# Altium project DIT_MCU_Board.PrjPcb
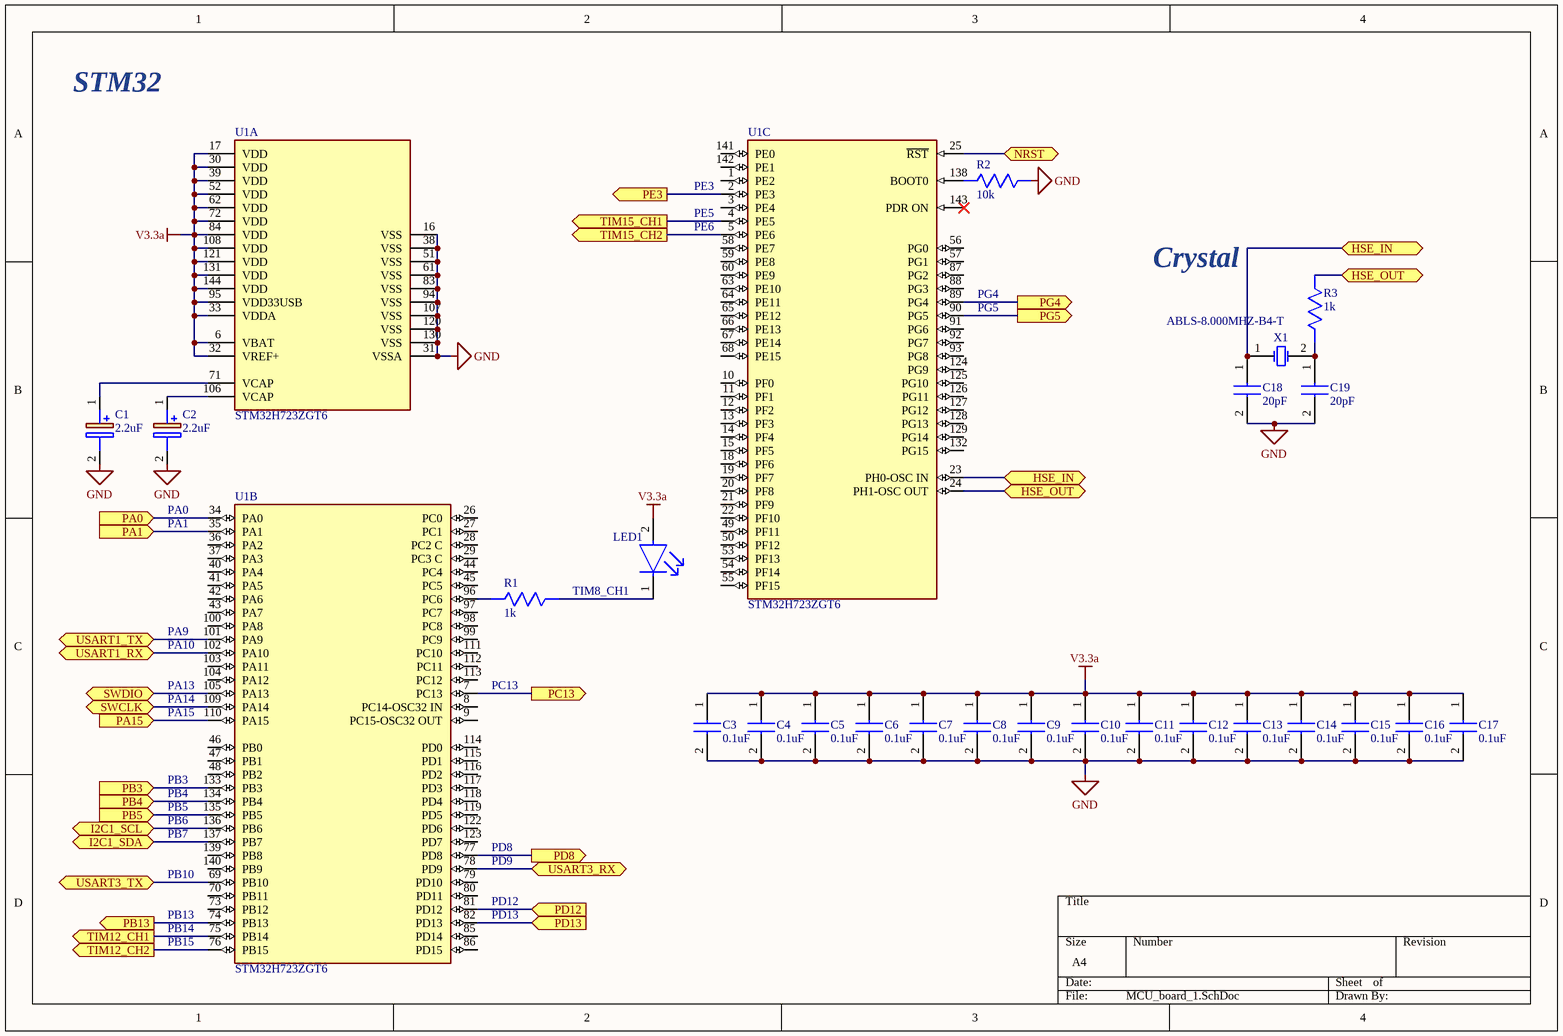
[diagram p0: MCU_board_1.SchDoc]
3 sheets, 82 parts. Net scope: flat (ports and power ports of the same name join across sheets).
Board file: PCB2.PcbDoc
Sheets:
  MCU_board_1.SchDoc
  MCU_board_2.SchDoc
  MCU_board_3.SchDoc

## Sheet MCU_board_1.SchDoc
size A4; SheetNumber: 1; SheetTotal: 3

### Parts
(Parts that share a designator on the sheet are numbered #1, #2 ... from top to bottom, then left to right.)
C1  2.2uF  [T598B]
C2  2.2uF  [T598B]
C3  0.1uF  [CAPC1608X90N]
C4  0.1uF  [CAPC1608X90N]
C5  0.1uF  [CAPC1608X90N]
C6  0.1uF  [CAPC1608X90N]
C7  0.1uF  [CAPC1608X90N]
C8  0.1uF  [CAPC1608X90N]
C9  0.1uF  [CAPC1608X90N]
C10  0.1uF  [CAPC1608X90N]
C11  0.1uF  [CAPC1608X90N]
C12  0.1uF  [CAPC1608X90N]
C13  0.1uF  [CAPC1608X90N]
C14  0.1uF  [CAPC1608X90N]
C15  0.1uF  [CAPC1608X90N]
C16  0.1uF  [CAPC1608X90N]
C17  0.1uF  [CAPC1608X90N]
C18  20pF  [CAPC1608X90N]
C19  20pF  [CAPC1608X90N]
LED1  150060RS75000  [FP-150060RS75000-MFG]  (value not drawn)
R1  1k  [RESC1608X55N]
R2  10k  [RESC1608X55N]
R3  1k  [RESC1608X55N]
U1#1  STM32H723ZGT6  [FP-LQFP144-1A-IPC_A]  (part A of 3)
U1#2  STM32H723ZGT6  [FP-LQFP144-1A-IPC_C]  (parts B,C of 3)
X1  ABLS-8.000MHZ-B4-T  [ABRA-ABLS-14.7456MHZ-B2-T_V]

### Ports
HSE_IN (bidir, see MCU_board_1[3B]), HSE_IN (bidir, see MCU_board_1[4A]), HSE_OUT (bidir, see MCU_board_1[3B]), HSE_OUT (bidir, see MCU_board_1[4B]), I2C1_SCL (bidir, see MCU_board_3[1B]), I2C1_SDA (bidir, see MCU_board_3[1B]), NRST (bidir, see MCU_board_2[1C], MCU_board_2[2C], MCU_board_3[1C]), PA0 (in, see MCU_board_3[3C]), PA1 (in, see MCU_board_3[3C]), PA15 (in, see MCU_board_3[2C]), PB3 (in, see MCU_board_3[1C], MCU_board_3[2C]), PB4 (in, see MCU_board_3[3C]), PB5 (in, see MCU_board_3[3C]), PB13 (out, see MCU_board_3[3D]), PC13 (out, see MCU_board_3[3D]), PD8 (out, see MCU_board_3[3D]), PD12 (in, see MCU_board_3[4C]), PD13 (in, see MCU_board_3[4C]), PE3 (out, see MCU_board_3[3D]), PG4 (out, see MCU_board_2[1D]), PG5 (out, see MCU_board_2[2D]), SWCLK (bidir, see MCU_board_3[2C]), SWDIO (bidir, see MCU_board_3[2C]), TIM12_CH1 (out, see MCU_board_3[3D]), TIM12_CH2 (out, see MCU_board_3[3D]), TIM15_CH1 (out, see MCU_board_3[3D]), TIM15_CH2 (out, see MCU_board_3[3C]), USART1_RX (bidir, see MCU_board_2[4C], MCU_board_3[1A]), USART1_TX (bidir, see MCU_board_2[4C], MCU_board_3[1A]), USART3_RX (bidir, see MCU_board_3[2A]), USART3_TX (bidir, see MCU_board_3[2A])

### Nets
GND: C1.2(-) C2.2(-) C3.2 C4.2 C5.2 C6.2 C7.2 C8.2 C9.2 C10.2 C11.2 C12.2 C13.2 C14.2 C15.2 C16.2 C17.2 C18.2 C19.2 R2.2 U1#1.16(VSS) U1#1.31(VSSA) U1#1.38(VSS) U1#1.51(VSS) U1#1.61(VSS) U1#1.83(VSS) U1#1.94(VSS) U1#1.107(VSS) U1#1.120(VSS) U1#1.130(VSS)
V3.3a: C3.1 C4.1 C5.1 C6.1 C7.1 C8.1 C9.1 C10.1 C11.1 C12.1 C13.1 C14.1 C15.1 C16.1 C17.1 LED1.2(A) U1#1.6(VBAT) U1#1.17(VDD) U1#1.30(VDD) U1#1.32(VREF+) U1#1.33(VDDA) U1#1.39(VDD) U1#1.52(VDD) U1#1.62(VDD) U1#1.72(VDD) U1#1.84(VDD) U1#1.95(VDD33USB) U1#1.108(VDD) U1#1.121(VDD) U1#1.131(VDD) U1#1.144(VDD)
NetC1_1: C1.1(+) U1#1.71(VCAP)
NetC2_1: C2.1(+) U1#1.106(VCAP)
NetC18_1: C18.1 U1#2.23(PH0-OSC_IN) X1.1(X1) ; port HSE_IN
NetC19_1: C19.1 R3.1 X1.2(X2)
NetC23_1: U1#2.25(~{RST}) ; port NRST
NetLED1_1: LED1.1(C) R1.2
NetP2_1: U1#2.89(PG4) ; port PG4
NetP3_1: U1#2.90(PG5) ; port PG5
NetP4_2: U1#2.101(PA9) ; port USART1_TX
NetP4_3: U1#2.102(PA10) ; port USART1_RX
NetP5_2: U1#2.69(PB10) ; port USART3_TX
NetP5_3: U1#2.78(PD9) ; port USART3_RX
NetP6_3: U1#2.137(PB7) ; port I2C1_SDA
NetP6_4: U1#2.136(PB6) ; port I2C1_SCL
NetP7_2: U1#2.105(PA13) ; port SWDIO
NetP7_5: U1#2.133(PB3) ; port PB3
NetP7_6: U1#2.109(PA14) ; port SWCLK
NetP8_1: U1#2.5(PE6) ; port TIM15_CH2
NetP8_2: U1#2.7(PC13) ; port PC13
NetP8_3: U1#2.4(PE5) ; port TIM15_CH1
NetP8_4: U1#2.2(PE3) ; port PE3
NetP8_5: U1#2.76(PB15) ; port TIM12_CH2
NetP8_6: U1#2.74(PB13) ; port PB13
NetP8_7: U1#2.75(PB14) ; port TIM12_CH1
NetP8_8: U1#2.77(PD8) ; port PD8
NetR1_1: R1.1 U1#2.96(PC6)
NetR2_1: R2.1 U1#2.138(BOOT0)
NetR3_2: R3.2 U1#2.24(PH1-OSC_OUT) ; port HSE_OUT
NetU1#2_34: U1#2.34(PA0) ; port PA0
NetU1#2_35: U1#2.35(PA1) ; port PA1
NetU1#2_81: U1#2.81(PD12) ; port PD12
NetU1#2_82: U1#2.82(PD13) ; port PD13
NetU1#2_110: U1#2.110(PA15) ; port PA15
NetU1#2_134: U1#2.134(PB4) ; port PB4
NetU1#2_135: U1#2.135(PB5) ; port PB5

Not connected (* = marked no-connect by the designer): U1#2 1(PE2) 3(PE4) 8(PC14-OSC32_IN) 9(PC15-OSC32_OUT) 10(PF0) 11(PF1) 12(PF2) 13(PF3) 14(PF4) 15(PF5) 18(PF6) 19(PF7) 20(PF8) 21(PF9) 22(PF10) 26(PC0) 27(PC1) 28(PC2_C) 29(PC3_C) 36(PA2) 37(PA3) 40(PA4) 41(PA5) 42(PA6) 43(PA7) 44(PC4) 45(PC5) 46(PB0) 47(PB1) 48(PB2) 49(PF11) 50(PF12) 53(PF13) 54(PF14) 55(PF15) 56(PG0) 57(PG1) 58(PE7) 59(PE8) 60(PE9) 63(PE10) 64(PE11) 65(PE12) 66(PE13) 67(PE14) 68(PE15) 70(PB11) 73(PB12) 79(PD10) 80(PD11) 85(PD14) 86(PD15) 87(PG2) 88(PG3) 91(PG6) 92(PG7) 93(PG8) 97(PC7) 98(PC8) 99(PC9) 100(PA8) 103(PA11) 104(PA12) 111(PC10) 112(PC11) 113(PC12) 114(PD0) 115(PD1) 116(PD2) 117(PD3) 118(PD4) 119(PD5) 122(PD6) 123(PD7) 124(PG9) 125(PG10) 126(PG11) 127(PG12) 128(PG13) 129(PG14) 132(PG15) 139(PB8) 140(PB9) 141(PE0) 142(PE1) 143(PDR_ON)*

### Notes on the sheet
- STM32
- (near U1#2) PE3
- (near U1#2) PE5
- (near U1#2) PE6
- (near U1#2) PG4
- (near U1#2) PG5
- Crystal
- PA0
- PA1
- (near U1#2) PA9
- (near U1#2) PA10
- TIM8_CH1
- (near U1#2) PA13
- (near U1#2) PA14
- (near U1#2) PA15
- (near U1#2) PC13
- (near U1#2) PB3
- (near U1#2) PB4
- (near U1#2) PB5
- (near U1#2) PB6
- (near U1#2) PB7
- (near U1#2) PD8
- (near U1#2) PB10
- (near U1#2) PB13
- (near U1#2) PD9
- (near U1#2) PD12
- (near U1#2) PD13
- (near U1#2) PB14
- (near U1#2) PB15

### Library data of the parts
C1 C2 = T598B225M035ATE150: Capacitor Polarised; Manufacturer_Name: KEMET; Datasheet Link: https://content.kemet.com/datasheets/KEM_T2073_T59X.pdf; Height: 2.1mm; Manufacturer_Part_Number: T598B225M035ATE150; Mouser Part Number: 80-T598B225M35ATE150; Mouser Price/Stock: https://www.mouser.co.uk/ProductDetail/KEMET/T598B225M035ATE150?qs=wnTfsH77Xs5uc%252Bb8LBvYtg%3D%3D
C3-C17 = GRM188R72A104MA35D: Capacitor; Manufacturer_Name: Murata Electronics; Height: 0.9mm; Manufacturer_Part_Number: GRM188R72A104MA35D; Mouser Part Number: 81-GRM188R72A104MA5D; Mouser Price/Stock: https://www.mouser.co.uk/ProductDetail/Murata-Electronics/GRM188R72A104MA35D?qs=QdePRyQsNGaEtttrWFG%2FPQ%3D%3D; Arrow Part Number: GRM188R72A104MA35D; Arrow Price/Stock: https://www.arrow.com/en/products/grm188r72a104ma35d/murata-manufacturing?region=nac
C18 C19 = 06035A200FAT2A: Capacitor; Manufacturer_Name: AVX; Datasheet Link: https://componentsearchengine.com/Datasheets/1/06031A100FAT2A.pdf; Height: 0.9mm; Manufacturer_Part_Number: 06035A200FAT2A; Mouser Part Number: 581-06035A200FAT2A; Mouser Price/Stock: https://www.mouser.co.uk/ProductDetail/AVX/06035A200FAT2A?qs=0yaOSdwiqWsd0YnmvPoF5Q%3D%3D
LED1 = CMP-1426-00001-2: LED RED CLEAR 0603 SMD; Luminous Intensity: 250mcd; Viewing Angle: 140°; Dominant Wavelength: 625nm; Test Current: 20mA; Forward Current: 30mA; Forward Voltage: 2V; Lens Color: Colorless; Lens Size: 0.7mm; Width: 0.8mm; Series: WL-SMCW; Color: Red; Min Operating Temperature: -40°C; RoHS Compliant: Yes; Height: 0.8mm; Package Quantity: 1; Packaging: Cut Tape; Mount: Surface Mount; Case/Package: 0603; Lens Transparency: Clear; Length: 1.6mm; Case Code (Imperial): 0603; Lens Style: Clear; Wavelength: 625nm; Max Operating Temperature: 85°C; Case Code (Metric): 1608
R1-R3 = CMP0603-FX-1003ELF: Resistor; Manufacturer_Name: Bourns; Datasheet Link: https://www.mouser.co.uk/datasheet/2/54/Bourns_CMP_Datasheet_05.28.20-1854233.pdf; Height: 0.55mm; Manufacturer_Part_Number: CMP0603-FX-1003ELF
U1#1 U1#2 = CMP-12105-000148-1: IC MCU 32BIT 1MB FLASH 144LQFP
X1 = CMP-2000-05726-1: Low Profile Crystal, 8.0 MHz, +/- 30 ppm, -20 to 70 degC, 2-Pin SMD, RoHS, Tape and Reel; Brand: ABRACON; Case Length: 11.4mm; Frequency Stability: 50PPM; ESR: 80Ohms; Case Height: 4.2mm; Tolerance: 30PPM; Frequency: 8MHz; Case Width: 4.7mm; Load Capacitance: 18pF; Datasheet Version: 04/2011; Termination Style: SMD/SMT; Dimensions: 4.7mmWx11.4mmLx4.2mmH; Packaging: Reel; Manufacturer: ABRACON; Package URL: http://www.abracon.com/Support/PackageDrawing/Resonators/ABLS-2D.pdf; Mounting Technology: SurfaceMount; Package Reference: ABLS-14.7456MHZ-B2-T; Product Category: Crystals; Package Description: 2-Pin Surface Mount Device, Body 11.4 x 4.7 mm; Package / Case: HC-49/US; Mounting Style: SMD/SMT; Operating Temperature Range: -20Cto+70C; Series: ABLS; Factory Pack Quantity: 1000; Datasheet URL: http://www.abracon.com/Resonators/abls.pdf; Manufacturer URL: http://www.abracon.com/; RoHS: Details; Type: LowProfileMicroprocessorCrystal

## Sheet MCU_board_2.SchDoc
size A4; SheetNumber: 2; SheetTotal: 3
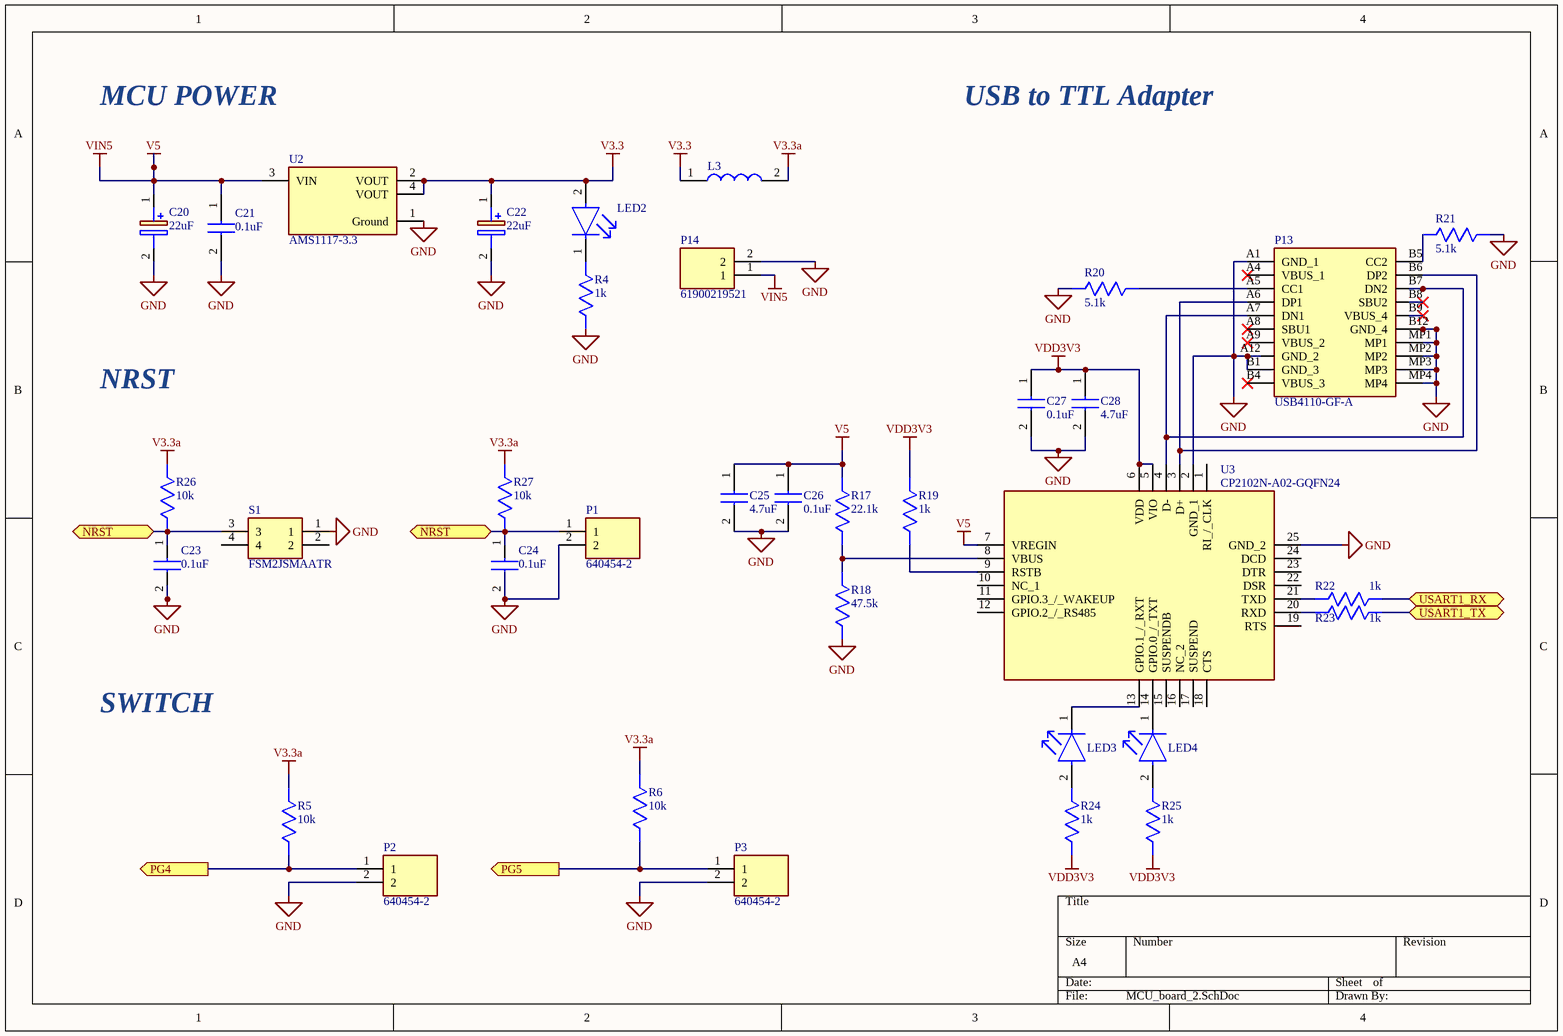
[diagram p1: MCU_board_2.SchDoc]

### Parts
C20  22uF  [CAPPM6032X280N]
C21  0.1uF  [C1608_Commercial]
C22  22uF  [CAPPM6032X280N]
C23  0.1uF  [C1608_Commercial]
C24  0.1uF  [C1608_Commercial]
C25  4.7uF  [CAPC1608X90N]
C26  0.1uF  [CAPC1608X90N]
C27  0.1uF  [CAPC1608X90N]
C28  4.7uF  [CAPC1608X90N]
L3  742792691  [LEDC1608X80N]  (value not drawn)
LED2  150060RS75000  [FP-150060RS75000-MFG]  (value not drawn)
LED3  150060RS75000  [FP-150060RS75000-MFG]  (value not drawn)
LED4  150060RS75000  [FP-150060RS75000-MFG]  (value not drawn)
P1  640454-2  [HDRV2W66P0X254_1X2_762X572X1003P]
P2  640454-2  [HDRV2W66P0X254_1X2_762X572X1003P]
P3  640454-2  [HDRV2W66P0X254_1X2_762X572X1003P]
P13  USB4110-GF-A  [USB4110GFA]
P14  61900219521  [SHDRRA2W64P0X254_1X2_508X1150X595P]
R4  1k  [RESC1608X55N]
R5  10k  [RESC1608X55N]
R6  10k  [RESC1608X55N]
R17  22.1k  [RESC1608X55N]
R18  47.5k  [RESC1608X55N]
R19  1k  [RESC1608X55N]
R20  5.1k  [RESC1608X55N]
R21  5.1k  [RESC1608X55N]
R22  1k  [RESC1608X55N]
R23  1k  [RESC1608X55N]
R24  1k  [RESC1608X55N]
R25  1k  [RESC1608X55N]
R26  10k  [RESC1608X55N]
R27  10k  [RESC1608X55N]
S1  FSM2JSMAATR  [FSM2J_1]
U2  AMS1117-3.3  [FP-AMS1117-IPC_C]
U3  CP2102N-A02-GQFN24  [QFN50P400X400X80-25N-D]

### Ports
NRST (bidir, see MCU_board_1[3A], MCU_board_2[1C], MCU_board_3[1C]), NRST (bidir, see MCU_board_1[3A], MCU_board_2[2C], MCU_board_3[1C]), PG4 (out, see MCU_board_1[3B]), PG5 (out, see MCU_board_1[3B]), USART1_RX (bidir, see MCU_board_1[1C], MCU_board_3[1A]), USART1_TX (bidir, see MCU_board_1[1C], MCU_board_3[1A])

### Nets
GND: C20.2(-) C21.2 C22.2(-) C23.2 C24.2 C25.2 C26.2 C27.2 C28.2 P1.2 P2.2 P3.2 P13.A1(GND_1) P13.A12(GND_2) P13.B1(GND_3) P13.B12(GND_4) P13.MP1 P13.MP2 P13.MP3 P13.MP4 P14.2 R4.2 R18.2 R20.2 R21.2 S1.1 U2.1(Ground) U3.2(GND_1) U3.25(GND_2)
V3.3: C22.1(+) L3.1 LED2.2(A) U2.2(VOUT) U2.4(VOUT)
V3.3a: L3.2 R5.2 R6.2 R26.2 R27.2
V5: C20.1(+) C21.1 C25.1 C26.1 P14.1 R17.1 U2.3(VIN) U3.7(VREGIN)  [also labelled VIN5]
VDD3V3: C27.1 C28.1 R19.1 R24.2 R25.2 U3.5(VIO) U3.6(VDD)
NetC23_1: C23.1 C24.1 P1.1 R26.1 R27.1 S1.3 ; port NRST
NetLED2_1: LED2.1(C) R4.1
NetLED3_1: LED3.1(C) U3.13(GPIO.1_/_RXT)
NetLED3_2: LED3.2(A) R24.1
NetLED4_1: LED4.1(C) U3.14(GPIO.0_/_TXT)
NetLED4_2: LED4.2(A) R25.1
NetP2_1: P2.1 R5.1 ; port PG4
NetP3_1: P3.1 R6.1 ; port PG5
NetP4_2: R23.2 ; port USART1_TX
NetP4_3: R22.2 ; port USART1_RX
NetP13_A5: P13.A5(CC1) R20.1
NetP13_A6: P13.A6(DP1) P13.B6(DP2) U3.3(D+)
NetP13_A7: P13.A7(DN1) P13.B7(DN2) U3.4(D-)
NetP13_B5: P13.B5(CC2) R21.1
NetR17_2: R17.2 R18.1 U3.8(VBUS)
NetR19_2: R19.2 U3.9(RSTB)
NetR22_1: R22.1 U3.21(TXD)
NetR23_1: R23.1 U3.20(RXD)

Not connected (* = marked no-connect by the designer): P13 A4(VBUS_1)* A8(SBU1)* A9(VBUS_2)* B4(VBUS_3)* B8(SBU2)* B9(VBUS_4)*; S1 2 4; U3 1(RI_/_CLK) 10(NC_1) 11(GPIO.3_/_WAKEUP) 12(GPIO.2_/_RS485) 15(SUSPENDB) 16(NC_2) 17(SUSPEND) 18(CTS) 19(RTS) 22(DSR) 23(DTR) 24(DCD)

### Notes on the sheet
- MCU POWER
- USB to TTL Adapter
- NRST
- SWITCH

### Library data of the parts
C20 C22 = TAJC226K025RNJ: Capacitor Polarised; Manufacturer_Name: AVX; Datasheet Link: http://datasheets.avx.com/TAJ.pdf; Height: 2.8mm; Manufacturer_Part_Number: TAJC226K025RNJ; Mouser Part Number: 581-TAJC226K025R; Mouser Price/Stock: https://www.mouser.co.uk/ProductDetail/AVX/TAJC226K025RNJ?qs=ZfDiupplM3TXvWbrzYGnnA%3D%3D; Arrow Part Number: TAJC226K025RNJ; Arrow Price/Stock: https://www.arrow.com/en/products/tajc226k025rnj/avx
C21 C23 C24 = C1608X7R1H334K080AC: Capacitor; Manufacturer_Name: TDK; Datasheet Link: https://product.tdk.com/system/files/dam/doc/product/capacitor/ceramic/mlcc/catalog/mlcc_commercial_general_en.pdf; Height: 0.9mm; Manufacturer_Part_Number: C1608X7R1H334K080AC; Mouser Part Number: 810-C1608X7R1H334K; Mouser Price/Stock: https://www.mouser.co.uk/ProductDetail/TDK/C1608X7R1H334K080AC?qs=NRhsANhppD%252BuOqJgCMjUlg%3D%3D; Arrow Part Number: C1608X7R1H334K080AC; Arrow Price/Stock: https://www.arrow.com/en/products/c1608x7r1h334k080ac/tdk
C25-C28 = GRM188R72A104MA35D: as C3 on sheet MCU_board_1; Height: 0.9mm; Manufacturer_Part_Number: GRM188R72A104MA35D; Mouser Part Number: 81-GRM188R72A104MA5D; Mouser Price/Stock: https://www.mouser.co.uk/ProductDetail/Murata-Electronics/GRM188R72A104MA35D?qs=QdePRyQsNGaEtttrWFG%2FPQ%3D%3D; Arrow Part Number: GRM188R72A104MA35D; Arrow Price/Stock: https://www.arrow.com/en/products/grm188r72a104ma35d/murata-manufacturing?region=nac
L3 = 742792691: Inductor; Manufacturer_Name: Wurth Elektronik; Height: 0.8mm; Manufacturer_Part_Number: 742792691; Mouser Part Number: 710-742792691; Mouser Price/Stock: https://www.mouser.com/Search/Refine.aspx?Keyword=710-742792691
LED2-LED4 = CMP-1426-00001-2: as LED1 on sheet MCU_board_1; Width: 0.8mm; Series: WL-SMCW; Color: Red; Min Operating Temperature: -40°C; RoHS Compliant: Yes; Height: 0.8mm; Package Quantity: 1; Packaging: Cut Tape; Mount: Surface Mount; Case/Package: 0603; Lens Transparency: Clear; Length: 1.6mm; Case Code (Imperial): 0603; Lens Style: Clear; Wavelength: 625nm; Max Operating Temperature: 85°C; Case Code (Metric): 1608
P1-P3 = 640454-2: Connector; Manufacturer_Name: TE Connectivity; Datasheet Link: https://datasheet.datasheetarchive.com/originals/distributors/Datasheets_SAMA/0152b3901a0ba380c7a54e62cba96e15.pdf; Height: 10.03mm; Manufacturer_Part_Number: 640454-2
P13 = USB4110-GF-A: Connector; Manufacturer_Name: GCT (GLOBAL CONNECTOR TECHNOLOGY); Datasheet Link: https://gct.co/files/drawings/usb4110.pdf; Height: 3.26mm; Manufacturer_Part_Number: USB4110-GF-A; Mouser Part Number: 640-USB4110-GF-A; Mouser Price/Stock: https://www.mouser.co.uk/ProductDetail/GCT/USB4110-GF-A?qs=KUoIvG%2F9IlYiZvIXQjyJeA%3D%3D
P14 = 61900219521: Connector; Manufacturer_Name: Wurth Elektronik; Datasheet Link: https://componentsearchengine.com/Datasheets/1/61900219521.pdf; Height: 5.95mm; Manufacturer_Part_Number: 61900219521; Mouser Part Number: 710-61900219521; Mouser Price/Stock: https://www.mouser.co.uk/ProductDetail/Wurth-Elektronik/61900219521?qs=W%252B2sBeLta1aXbrC28D3FtA%3D%3D
R4-R6 R17-R27 = CMP0603-FX-1003ELF: Resistor; Manufacturer_Name: Bourns; Datasheet Link: https://www.mouser.co.uk/datasheet/2/54/Bourns_CMP_Datasheet_05.28.20-1854233.pdf; Height: 0.55mm; Manufacturer_Part_Number: CMP0603-FX-1003ELF
S1 = FSM2JSMAATR: Switch; Manufacturer_Name: TE Connectivity; Datasheet Link: http://www.te.com/commerce/DocumentDelivery/DDEController?Action=showdoc&DocId=Customer+Drawing%7F2-1437565-7%7FV%7Fpdf%7FEnglish%7FENG_CD_2-1437565-7_V.pdf%7F2-1437565-9; Manufacturer_Part_Number: FSM2JSMAATR
U2 = CMP-209535-000001-1: LDO Voltage Regulators 1A, 3.3V; Manufacturer: Advanced Monolithic Systems; Dropout Voltage: 1.1V; Output Type: Fixed; Nominal Supply Current: 5mA; Max Power Dissipation: 1.2W; Max Supply Voltage: 15V; Number Of Outputs: 1; Standoff Height: 0.64mm; Max Junction Temp: +125°C; Height: 1.8mm; Package: AMS1117; Device Class L2: Power Management ICs; ComponentLink2Description: Datasheet; ComponentLink2URL: http://www.advanced-monolithic.com/pdf/ds1117.pdf; Category: IC; RoHS: TRUE; Automotive: No; Device Class L1: Integrated Circuits (ICs); Output Current: 1A; Device Class L3: Voltage Regulators - Linear; Temperature: -40°C to +125°C; Output Voltage: 3.3V; Manufacturer Part Number: AMS1117-3.3; Temperature Range Low: -40°C; Octopart: https://octopart.com/ams1117-3.3-advanced+monolithic+systems-25899300; Lead Free: Yes; Ipc Land Pattern Name: SOT229P700X180-4; Temperature Range High: +125°C
U3 = CP2102N-A02-GQFN24: Integrated Circuit; Manufacturer_Name: Silicon Labs; Datasheet Link: https://componentsearchengine.com/Datasheets/1/CP2102N-A02-GQFN24.pdf; Height: 0.8mm; Manufacturer_Part_Number: CP2102N-A02-GQFN24; Mouser Part Number: 634-CP2102NA02GQFN24; Mouser Price/Stock: https://www.mouser.co.uk/ProductDetail/Silicon-Labs/CP2102N-A02-GQFN24?qs=u16ybLDytRYKabtL%2FE7DZA%3D%3D; Arrow Part Number: CP2102N-A02-GQFN24; Arrow Price/Stock: https://www.arrow.com/en/products/cp2102n-a02-gqfn24/silicon-labs

## Sheet MCU_board_3.SchDoc
size A4; SheetNumber: 3; SheetTotal: 3
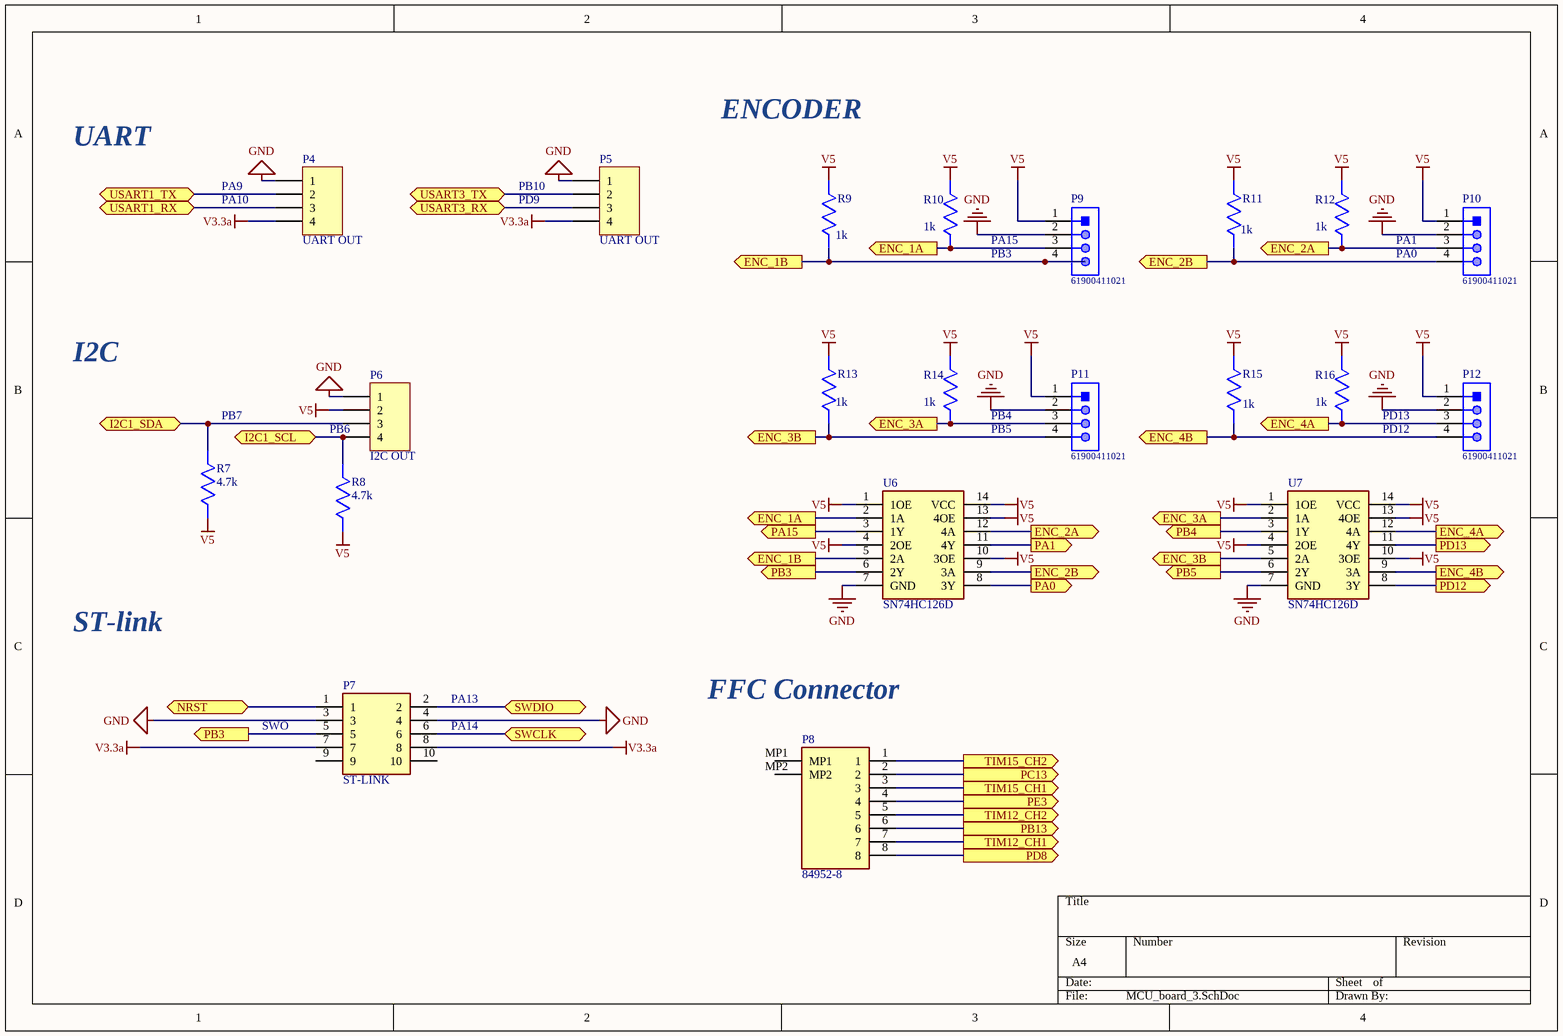
[diagram p2: MCU_board_3.SchDoc]

### Parts
P4  UART OUT  [HDR1X4]
P5  UART OUT  [HDR1X4]
P6  I2C OUT  [HDR1X4]
P7  ST-LINK  [SHDR10W66P254_2X5_2035X880X920P]
P8  84952-8  [849528]
P9  61900411021  [61900411021]
P10  61900411021  [61900411021]
P11  61900411021  [61900411021]
P12  61900411021  [61900411021]
R7  4.7k  [RESC1608X55N]
R8  4.7k  [RESC1608X55N]
R9  1k  [RESC1608X55N]
R10  1k  [RESC1608X55N]
R11  1k  [RESC1608X55N]
R12  1k  [RESC1608X55N]
R13  1k  [RESC1608X55N]
R14  1k  [RESC1608X55N]
R15  1k  [RESC1608X55N]
R16  1k  [RESC1608X55N]
U6  SN74HC126D  [SOIC127P600X175-14N]
U7  SN74HC126D  [SOIC127P600X175-14N]

### Ports
ENC_1A (out, see MCU_board_3[2C]), ENC_1A (out, see MCU_board_3[3A]), ENC_1B (out, see MCU_board_3[2B]), ENC_1B (out, see MCU_board_3[2C]), ENC_2A (out, see MCU_board_3[3C]), ENC_2A (out, see MCU_board_3[4A]), ENC_2B (out, see MCU_board_3[3B]), ENC_2B (out, see MCU_board_3[3C]), ENC_3A (out, see MCU_board_3[3B]), ENC_3A (out, see MCU_board_3[3C]), ENC_3B (out, see MCU_board_3[2B]), ENC_3B (out, see MCU_board_3[3C]), ENC_4A (out, see MCU_board_3[4B]), ENC_4A (out, see MCU_board_3[4C]), ENC_4B (out, see MCU_board_3[3B]), ENC_4B (out, see MCU_board_3[4C]), I2C1_SCL (bidir, see MCU_board_1[1D]), I2C1_SDA (bidir, see MCU_board_1[1D]), NRST (bidir, see MCU_board_1[3A], MCU_board_2[1C], MCU_board_2[2C]), PA0 (out, see MCU_board_1[1C]), PA1 (out, see MCU_board_1[1C]), PA15 (out, see MCU_board_1[1C]), PB3 (out, see MCU_board_1[1D], MCU_board_3[1C]), PB3 (out, see MCU_board_1[1D], MCU_board_3[2C]), PB4 (out, see MCU_board_1[1D]), PB5 (out, see MCU_board_1[1D]), PB13 (out, see MCU_board_1[1D]), PC13 (out, see MCU_board_1[2C]), PD8 (out, see MCU_board_1[2D]), PD12 (out, see MCU_board_1[2D]), PD13 (out, see MCU_board_1[2D]), PE3 (out, see MCU_board_1[2A]), SWCLK (bidir, see MCU_board_1[1C]), SWDIO (bidir, see MCU_board_1[1C]), TIM12_CH1 (out, see MCU_board_1[1D]), TIM12_CH2 (out, see MCU_board_1[1D]), TIM15_CH1 (out, see MCU_board_1[2A]), TIM15_CH2 (out, see MCU_board_1[2A]), USART1_RX (bidir, see MCU_board_1[1C], MCU_board_2[4C]), USART1_TX (bidir, see MCU_board_1[1C], MCU_board_2[4C]), USART3_RX (bidir, see MCU_board_1[2D]), USART3_TX (bidir, see MCU_board_1[1D])

### Nets
GND: P4.1 P5.1 P6.1 P7.3 P7.4 P9.2 P10.2 P11.2 P12.2 U6.7(GND) U7.7(GND)
V3.3a: P4.4 P5.4 P7.7 P7.8
V5: P6.2 P9.1 P10.1 P11.1 P12.1 R7.1 R8.1 R9.2 R10.2 R11.2 R12.2 R13.2 R14.2 R15.2 R16.2 U6.1(1OE) U6.4(2OE) U6.10(3OE) U6.13(4OE) U6.14(VCC) U7.1(1OE) U7.4(2OE) U7.10(3OE) U7.13(4OE) U7.14(VCC)
NetC23_1: P7.1 ; port NRST
NetP4_2: P4.2 ; port USART1_TX
NetP4_3: P4.3 ; port USART1_RX
NetP5_2: P5.2 ; port USART3_TX
NetP5_3: P5.3 ; port USART3_RX
NetP6_3: P6.3 R7.2 ; port I2C1_SDA
NetP6_4: P6.4 R8.2 ; port I2C1_SCL
NetP7_2: P7.2 ; port SWDIO
NetP7_5: P7.5 U6.6(2Y) ; port PB3
NetP7_6: P7.6 ; port SWCLK
NetP8_1: P8.1 ; port TIM15_CH2
NetP8_2: P8.2 ; port PC13
NetP8_3: P8.3 ; port TIM15_CH1
NetP8_4: P8.4 ; port PE3
NetP8_5: P8.5 ; port TIM12_CH2
NetP8_6: P8.6 ; port PB13
NetP8_7: P8.7 ; port TIM12_CH1
NetP8_8: P8.8 ; port PD8
NetP9_3: P9.3 R10.1 U6.2(1A) ; port ENC_1A
NetP9_4: P9.4 R9.1 U6.5(2A) ; port ENC_1B
NetP10_3: P10.3 R12.1 U6.12(4A) ; port ENC_2A
NetP10_4: P10.4 R11.1 U6.9(3A) ; port ENC_2B
NetP11_3: P11.3 R14.1 U7.2(1A) ; port ENC_3A
NetP11_4: P11.4 R13.1 U7.5(2A) ; port ENC_3B
NetP12_3: P12.3 R16.1 U7.12(4A) ; port ENC_4A
NetP12_4: P12.4 R15.1 U7.9(3A) ; port ENC_4B
NetU1#2_34: U6.8(3Y) ; port PA0
NetU1#2_35: U6.11(4Y) ; port PA1
NetU1#2_81: U7.8(3Y) ; port PD12
NetU1#2_82: U7.11(4Y) ; port PD13
NetU1#2_110: U6.3(1Y) ; port PA15
NetU1#2_134: U7.3(1Y) ; port PB4
NetU1#2_135: U7.6(2Y) ; port PB5

Not connected (* = marked no-connect by the designer): P7 9 10; P8 MP1 MP2

### Notes on the sheet
- UART
- ENCODER
- PA9
- PA10
- PB10
- PD9
- PA15
- PA1
- PB3
- PA0
- I2C
- (near R7) PB7
- (near P6) PB6
- PB4
- PB5
- PD13
- PD12
- ST-link
- (near P7) PA13
- FFC Connector
- SWO
- (near P7) PA14

### Library data of the parts
P4-P6 = Header 4: Header, 4-Pin; LatestRevisionDate: 17-Jul-2002; LatestRevisionNote: Re-released for DXP Platform.; Publisher: Altium Limited
P7 = 1-1634688-0: Connector; Manufacturer_Name: TE Connectivity; Datasheet Link: https://componentsearchengine.com/Datasheets/2/1-1634688-0.pdf; Height: 9.2mm; Manufacturer_Part_Number: 1-1634688-0
P8 = 84952-8: Connector; Manufacturer_Name: TE Connectivity; Datasheet Link: https://www.te.com/commerce/DocumentDelivery/DDEController?Action=showdoc&DocId=Customer+Drawing%7F84952%7FA4%7Fpdf%7FEnglish%7FENG_CD_84952_A4.pdf%7F84952-8; Height: 2.74mm; Manufacturer_Part_Number: 84952-8; Mouser Part Number: 571-84952-8; Mouser Price/Stock: https://www.mouser.co.uk/ProductDetail/TE-Connectivity/84952-8?qs=uUkeXfjQ8uTKEYAHE0dNDQ%3D%3D; Arrow Part Number: 84952-8; Arrow Price/Stock: https://www.arrow.com/en/products/84952-8/te-connectivity?region=europe
P9-P12 = CMP-1502-00594-1: Male Bottom Locking Header WR-WTB, THT, Right Angled, pitch 2.54 mm, 1 x 4 position; Manufacturer: Wurth Elektronik; Position: 1x4; Working Voltage: 250VAC; Pitch: 2.54mm; Contact Resistance: 20mOhm; Part Number: 61900411021; Operating Temperature: -40to105degC; Orientation: RightAngled; Packaging: Bag; Datasheet URL: https://katalog.we-online.de/em/datasheet/6190xx11021.pdf; Package Reference: 61900411021; Publisher: WurthElektronik; Mounting Technology: THT; Manufacturer URL: http://www.we-online.de; Gender: Male
R7-R16 = CMP0603-FX-1003ELF: Resistor; Manufacturer_Name: Bourns; Datasheet Link: https://www.mouser.co.uk/datasheet/2/54/Bourns_CMP_Datasheet_05.28.20-1854233.pdf; Height: 0.55mm; Manufacturer_Part_Number: CMP0603-FX-1003ELF
U6 U7 = SN74HC126D: Integrated Circuit; Manufacturer_Name: Texas Instruments; Datasheet Link: http://www.ti.com/lit/gpn/sn74hc126; Height: 1.75mm; Manufacturer_Part_Number: SN74HC126D; Mouser Part Number: 595-SN74HC126D; Mouser Price/Stock: https://www.mouser.co.uk/ProductDetail/Texas-Instruments/SN74HC126D?qs=FM6NhYOeeBWM0b9Ig2w%252BaQ%3D%3D; Arrow Part Number: SN74HC126D; Arrow Price/Stock: https://www.arrow.com/en/products/sn74hc126d/texas-instruments

## Nets that join several sheets
GND: MCU_board_1 (30 pins), MCU_board_2 (29 pins), MCU_board_3 (11 pins)
V3.3a: MCU_board_1 (31 pins), MCU_board_2 (5 pins), MCU_board_3 (P4.4 P5.4 P7.7 P7.8)
V5: MCU_board_2 (8 pins), MCU_board_3 (25 pins)
NetC23_1: MCU_board_1 (U1#2.25), MCU_board_2 (6 pins), MCU_board_3 (P7.1)
NetP2_1: MCU_board_1 (U1#2.89), MCU_board_2 (P2.1 R5.1)
NetP3_1: MCU_board_1 (U1#2.90), MCU_board_2 (P3.1 R6.1)
NetP4_2: MCU_board_1 (U1#2.101), MCU_board_2 (R23.2), MCU_board_3 (P4.2)
NetP4_3: MCU_board_1 (U1#2.102), MCU_board_2 (R22.2), MCU_board_3 (P4.3)
NetP5_2: MCU_board_1 (U1#2.69), MCU_board_3 (P5.2)
NetP5_3: MCU_board_1 (U1#2.78), MCU_board_3 (P5.3)
NetP6_3: MCU_board_1 (U1#2.137), MCU_board_3 (P6.3 R7.2)
NetP6_4: MCU_board_1 (U1#2.136), MCU_board_3 (P6.4 R8.2)
NetP7_2: MCU_board_1 (U1#2.105), MCU_board_3 (P7.2)
NetP7_5: MCU_board_1 (U1#2.133), MCU_board_3 (P7.5 U6.6)
NetP7_6: MCU_board_1 (U1#2.109), MCU_board_3 (P7.6)
NetP8_1: MCU_board_1 (U1#2.5), MCU_board_3 (P8.1)
NetP8_2: MCU_board_1 (U1#2.7), MCU_board_3 (P8.2)
NetP8_3: MCU_board_1 (U1#2.4), MCU_board_3 (P8.3)
NetP8_4: MCU_board_1 (U1#2.2), MCU_board_3 (P8.4)
NetP8_5: MCU_board_1 (U1#2.76), MCU_board_3 (P8.5)
NetP8_6: MCU_board_1 (U1#2.74), MCU_board_3 (P8.6)
NetP8_7: MCU_board_1 (U1#2.75), MCU_board_3 (P8.7)
NetP8_8: MCU_board_1 (U1#2.77), MCU_board_3 (P8.8)
NetU1#2_34: MCU_board_1 (U1#2.34), MCU_board_3 (U6.8)
NetU1#2_35: MCU_board_1 (U1#2.35), MCU_board_3 (U6.11)
NetU1#2_81: MCU_board_1 (U1#2.81), MCU_board_3 (U7.8)
NetU1#2_82: MCU_board_1 (U1#2.82), MCU_board_3 (U7.11)
NetU1#2_110: MCU_board_1 (U1#2.110), MCU_board_3 (U6.3)
NetU1#2_134: MCU_board_1 (U1#2.134), MCU_board_3 (U7.3)
NetU1#2_135: MCU_board_1 (U1#2.135), MCU_board_3 (U7.6)